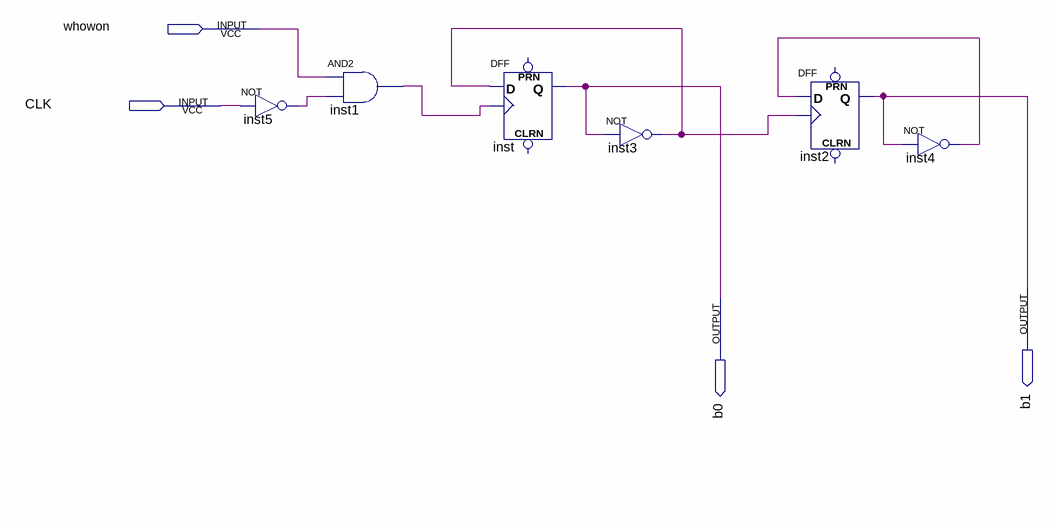
[diagram p0: schematic sheet]
// Quartus schematic counter.bdf as structural Verilog: 6 symbols, 4 pins
module counter (
  input  whowon,
  input  CLK,
  output b1,
  output b0
);

  wire inst1_out, inst3_out, inst4_out, inst5_out;

  not inst5 (inst5_out, CLK);
  and inst1 (inst1_out, whowon, inst5_out);
  DFF inst (.CLK(inst1_out), .D(inst3_out), .Q(b0));  // open: CLRN, PRN
  not inst3 (inst3_out, b0);
  DFF inst2 (.CLK(inst3_out), .D(inst4_out), .Q(b1));  // open: CLRN, PRN
  not inst4 (inst4_out, b1);
endmodule
